# EAGLE design fuse_holder (EAGLE 9.1.3)
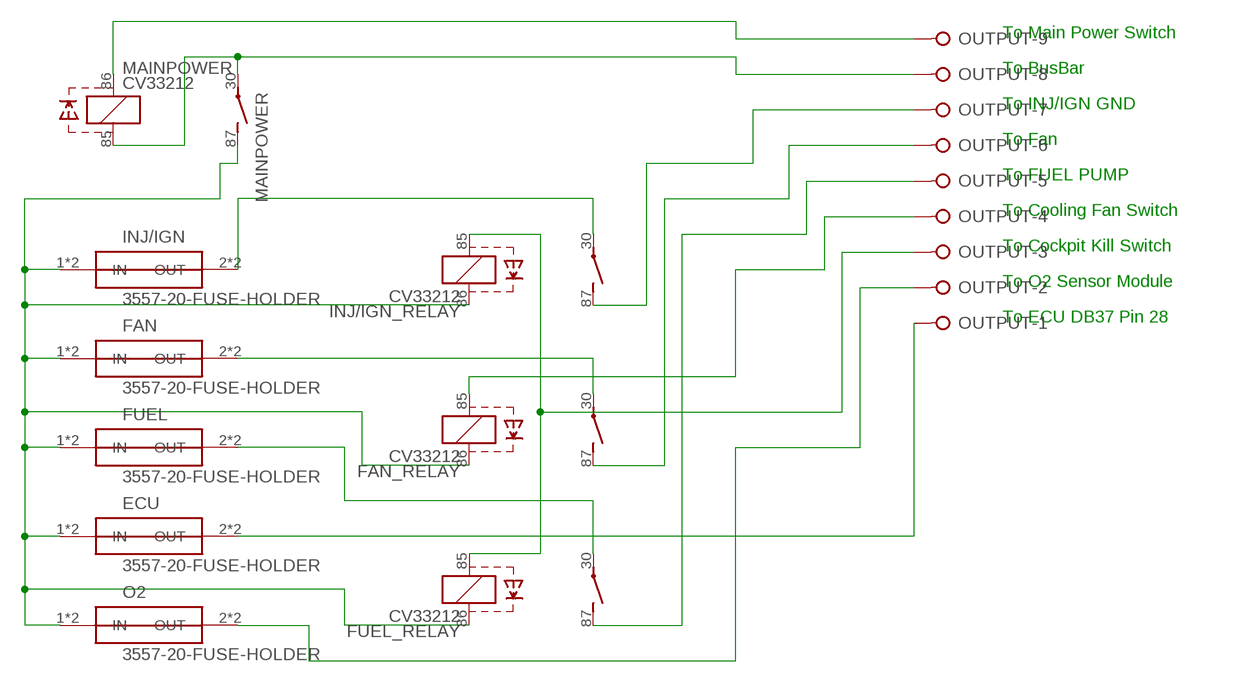
[diagram p0: schematic, sheet 1]

## Parts
ECU  3557-20-FUSE-HOLDER  [3557-20-FUSE-HOLDER]
FAN  3557-20-FUSE-HOLDER  [3557-20-FUSE-HOLDER]
FAN_RELAY  CV33212  [CV1A-MICRO-280]
FUEL  3557-20-FUSE-HOLDER  [3557-20-FUSE-HOLDER]
FUEL_RELAY  CV33212  [CV1A-MICRO-280]
INJ/IGN  3557-20-FUSE-HOLDER  [3557-20-FUSE-HOLDER]
INJ/IGN_RELAY  CV33212  [CV1A-MICRO-280]
MAINPOWER  CV33212  [CV1A-MICRO-280]
O2  3557-20-FUSE-HOLDER  [3557-20-FUSE-HOLDER]
OUTPUT  W237-09P  [W237-9P]

## Nets
INJ/IGN_RELAY: ECU.1(IN) ECU.3(IN) FAN.1(IN) FAN.3(IN) FAN_RELAY.86(+) FUEL.1(IN) FUEL.3(IN) FUEL_RELAY.86(+) INJ/IGN.1(IN) INJ/IGN.3(IN) INJ/IGN_RELAY.86(+) MAINPOWER.87(S) O2.1(IN) O2.3(IN)
N$1: MAINPOWER.86(+) OUTPUT.9
N$2: MAINPOWER.30(P) MAINPOWER.85(-) OUTPUT.8
N$3: INJ/IGN.2(OUT) INJ/IGN.4(OUT) INJ/IGN_RELAY.30(P)
N$4: FAN.2(OUT) FAN.4(OUT) FAN_RELAY.30(P)
N$5: FUEL.2(OUT) FUEL.4(OUT) FUEL_RELAY.30(P)
N$6: INJ/IGN_RELAY.87(S) OUTPUT.7
N$7: FAN_RELAY.87(S) OUTPUT.6
N$8: FUEL_RELAY.87(S)
N$9: FUEL_RELAY.85(-) INJ/IGN_RELAY.85(-) OUTPUT.3
N$10: FAN_RELAY.85(-) OUTPUT.4
N$11: OUTPUT.5
N$12: O2.2(OUT) O2.4(OUT) OUTPUT.2
N$13: ECU.2(OUT) ECU.4(OUT) OUTPUT.1

## Notes on the sheet
- To Main Power Switch
- To BusBar
- To INJ/IGN GND
- To Fan
- To FUEL PUMP
- To Cooling Fan Switch
- To Cockpit Kill Switch
- To O2 Sensor Module
- To ECU DB37 Pin 28

## Library data of the parts
ECU FAN FUEL INJ/IGN O2 = FSAE:3557-20-FUSE-HOLDER
FAN_RELAY FUEL_RELAY INJ/IGN_RELAY MAINPOWER = relay:CV33*: AUTOMOTIVE LOW PROFILE MICRO-280 RELAY NAiS Source: http://www.mew-europe.com/.. en_ds_61214_0000.pdf; OC_FARNELL: unknown; OC_NEWARK: unknown
OUTPUT = con-wago-508:W237-09P: WAGO SREW CLAMP; OC_FARNELL: unknown; OC_NEWARK: unknown

## Net classes
0 default: width 0.762 mm, drill 1.016 mm, clearance 0.508 mm

## Board
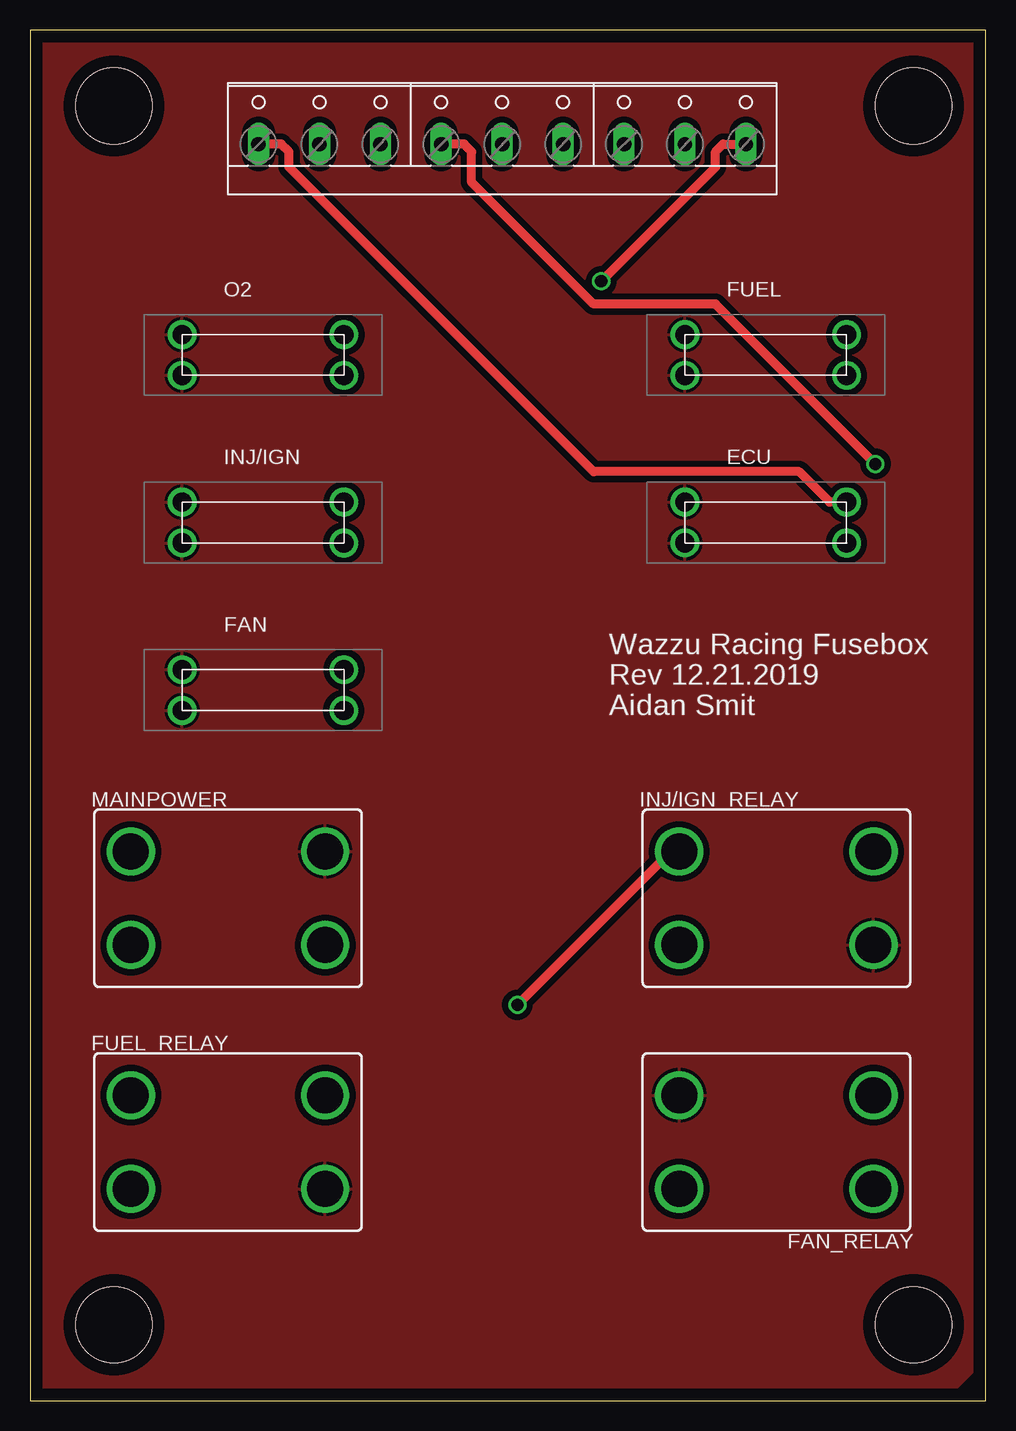
[diagram p1: board, top side]
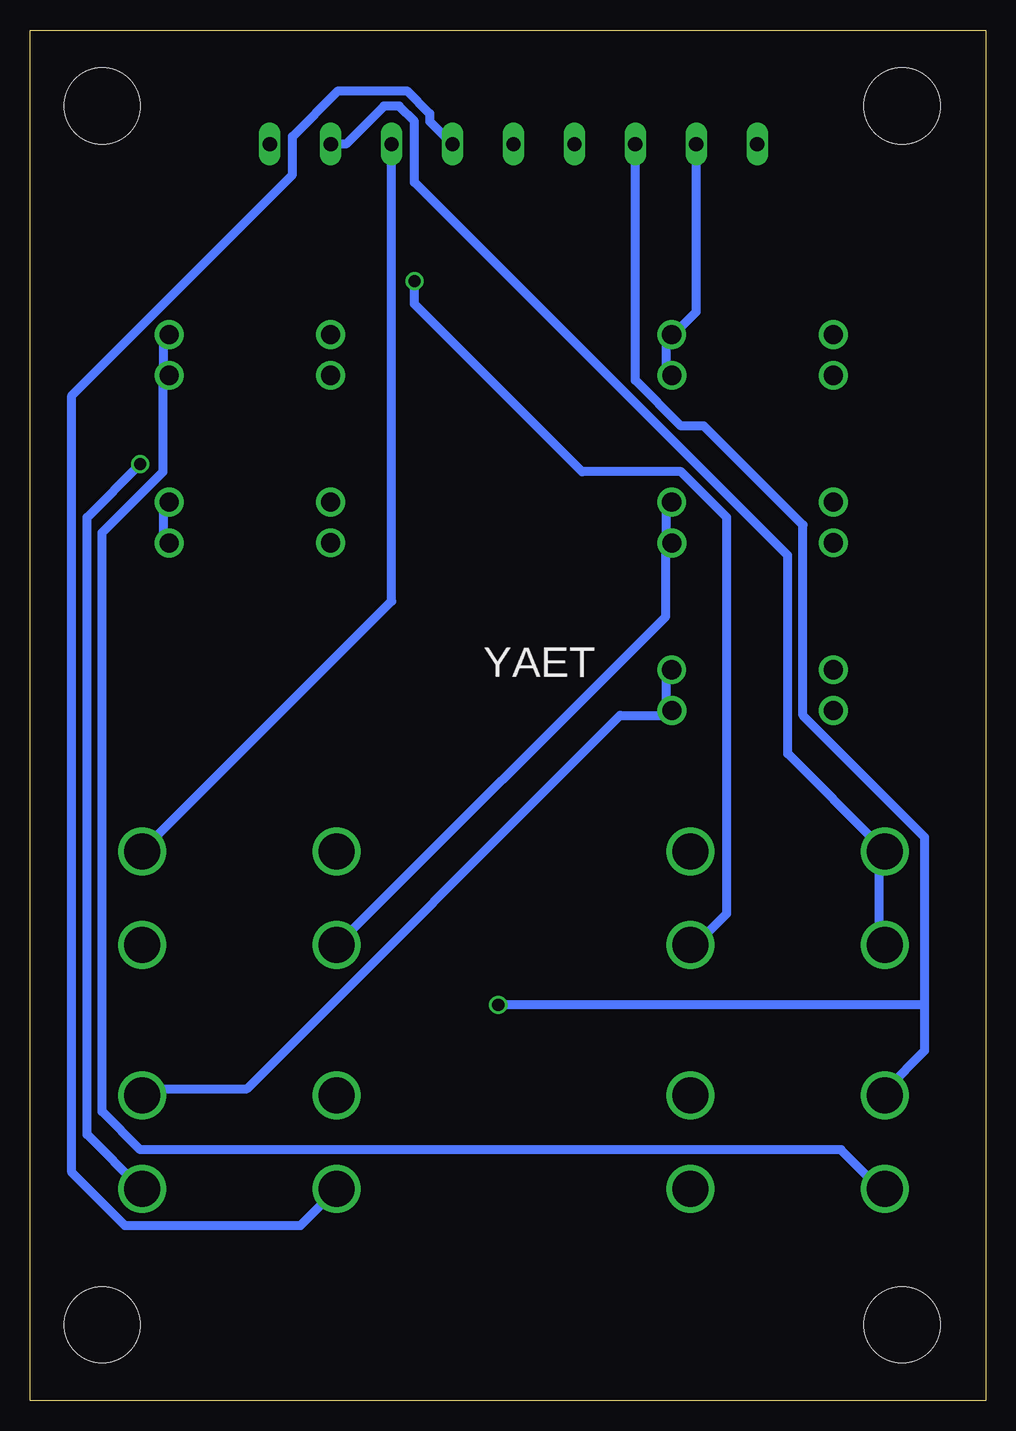
[diagram p2: board, bottom side, seen from below]

Size 79.68 x 114.29 mm. Coordinates in mm from the lower left corner, seen from the top.
Outline: 0,0 79.68,0 79.68,114.29 0,114.29 0,0
Copper layers (1*16): Top 0.035mm / dielectric 1.5mm / Bottom 0.035mm
Design rules "default": minimum track width 6mil, minimum drill 0.35mm, track to track 6mil, track to pad 6mil, pad to pad 6mil, via to via 6mil, smd to smd 6mil, copper to edge 40mil, drill to drill 6mil, minimum pad ring 10mil, minimum via ring 8mil, stop-mask expansion 4mil, vias tented up to drill 0mil, thermal gap 10mil
Holes 6.35 mm at 6.98,107.95 73.66,107.95 6.98,6.35 73.66,6.35

### Footprints (pad centres in the part's own frame; a part is rotated, then mirrored left to right if it is on the bottom)
3557-20-FUSE-HOLDER = drill 1.6: 1 -0.003,0.004; 2 13.474,-0.001; 3 -0.003,-3.397; 4 13.466,-3.403
CV1A-MICRO-280 = drill 3: 30 -8.1,-3.9; 85 -8.1,3.9; 86 8.1,-3.9; 87 8.1,3.9
W237-9P = drill 1.194 long: 1 -20.32,-0.635; 2 -15.24,-0.635; 3 -10.16,-0.635; 4 -5.08,-0.635; 5 0,-0.635; 6 5.08,-0.635; 7 10.16,-0.635; 8 15.24,-0.635; 9 20.32,-0.635

### Placement (x,y rotation side)
ECU  54.61,74.93 0 top
FAN  12.7,60.96 0 top
FAN_RELAY  62.23,21.59 180 top
FUEL  54.61,88.9 0 top
FUEL_RELAY  16.51,21.59 0 top
INJ/IGN  12.7,74.93 0 top
INJ/IGN_RELAY  62.23,41.91 0 top
MAINPOWER  16.51,41.91 0 top
O2  12.7,88.9 0 top
OUTPUT  39.37,105.41 0 top

### Tracks (layer width: path | path; a pad name or v marks a point on that pad's centre or on a via)
INJ/IGN_RELAY
  pour Top: -2.54,116.84 82.55,116.84 83.82,115.57 83.82,7.62 80.01,3.81 72.39,-3.81 -3.81,-3.81 -3.81,115.57
N$1  (via drill 1.02)
  Top 0.762: OUTPUT.9 57.78,104.77 57.15,104.14 57.15,102.87 v47.62,93.34
  Bottom 0.762: v47.62,93.34 47.62,91.44 33.66,77.47 25.4,77.47 21.59,73.66 21.59,40.64 24.13,38.1 MAINPOWER.86
N$2
  Bottom 0.762: OUTPUT.8 53.34,104.77 50.16,107.95 48.89,107.95 47.62,106.68 47.62,101.6 16.51,70.48 16.51,53.98 8.89,46.36 MAINPOWER.85 8.89,45.72 8.89,38.1 MAINPOWER.30
N$3
  Bottom 0.762: INJ/IGN.2 26.67,74.29 26.67,71.75 INJ/IGN.4 26.67,71.12 26.67,65.41 53.98,38.1 INJ/IGN_RELAY.30
N$4
  Bottom 0.762: FAN.2 26.67,60.33 26.67,57.79 FAN.4 26.67,57.15 30.48,57.15 61.59,26.03 69.85,26.03 FAN_RELAY.30
N$5
  Bottom 0.762: FUEL.2 68.58,88.27 68.58,85.72 FUEL.4 68.58,85.09 68.58,77.47 73.66,72.39 73.66,24.13 70.48,20.95 12.06,20.95 8.89,17.78 FUEL_RELAY.30
N$6
  Bottom 0.762: OUTPUT.7 49.53,66.67 69.85,46.36 INJ/IGN_RELAY.87
N$7
  Bottom 0.762: OUTPUT.6 46.35,106.68 46.35,107.31 48.26,109.22 53.98,109.22 57.78,105.41 57.78,102.23 76.2,83.82 76.2,19.05 71.75,14.61 57.15,14.61 54.61,17.14 FAN_RELAY.87
N$9  (via drill 1.02)
  Top 0.762: v40.64,33.02 53.34,45.72 53.98,45.72 INJ/IGN_RELAY.85
  Bottom 0.762: OUTPUT.3 29.21,85.09 25.4,81.28 23.49,81.28 15.24,73.02 15.24,57.15 5.08,46.99 5.08,33.02 | 5.08,33.02 5.08,29.21 8.25,26.03 FUEL_RELAY.85 | 5.08,33.02 v40.64,33.02
N$10  (via drill 1.02)
  Top 0.762: OUTPUT.4 36.2,104.77 36.83,104.14 36.83,101.6 46.99,91.44 57.15,91.44 v70.48,78.1
  Bottom 0.762: v70.48,78.1 74.93,73.66 74.93,22.23 70.48,17.78 FAN_RELAY.85
N$12
  Bottom 0.762: OUTPUT.2 24.13,90.8 26.03,88.9 O2.2 26.67,88.27 26.67,85.72 O2.4
N$13
  Top 0.762: OUTPUT.1 20.95,104.77 21.59,104.14 21.59,102.87 46.99,77.47 64.14,77.47 66.67,74.93 67.94,74.93 ECU.2
  Bottom 0.762: ECU.4 68.58,71.75 68.58,74.29 ECU.2

### Text on the board
tNames: Wazzu Racing Fusebox | Rev 12.21.2019 | Aidan Smit
bNames: YAET